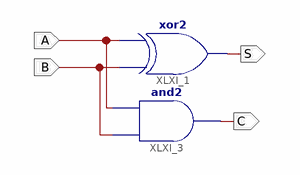
[diagram p0: schematic sheet 1]
// Xilinx ISE schematic HA.sch (spartan3e) as structural Verilog: 2 symbols, 4 ports
module HA (
  input  A,
  input  B,
  output S,
  output C
);

  xor XLXI_1 (S, B, A);
  and XLXI_3 (C, B, A);
endmodule
